# Altium schematic sheet controltemperature.SchDoc
size A
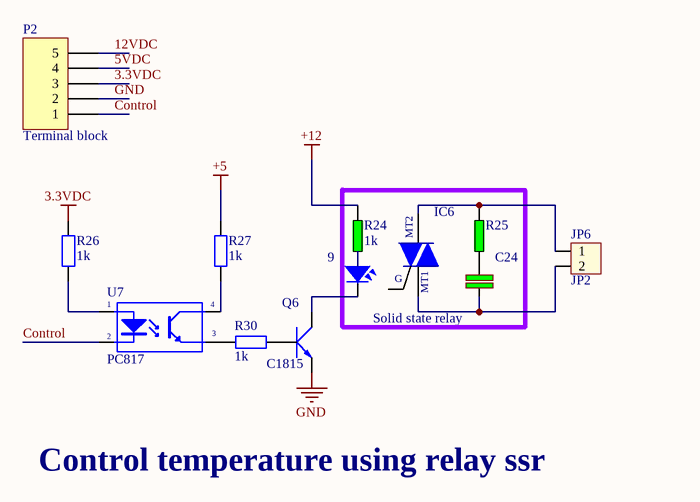
[diagram p0: controltemperature.SchDoc]

## Parts
9  Solid state relay  [LED-3]
C24  (no value)  [CN1]
IC6  (no value)  [QTO-220]
JP6  JP2  [CON2]
P2  Terminal block  [HDR1X5]
Q6  C1815  [QTO-92]
R24  1k  [SM-1206]
R25  (no value)  [SM-1206]
R26  1k  [R1/4W]
R27  1k  [R1/4W]
R30  1k  [R1/4W]
U7  PC817  [DIP4/W0.3]

## Nets
3.3VDC: P2.3 R26.2
+5: R27.2
+12: R24.2
GND: P2.2 Q6.1(E)
5VDC: P2.4
12VDC: P2.5
Control: P2.1 U7.2(K)
Net9_1: 9.1 R24.1
Net9_2: 9.2 Q6.2(C)
NetC24_1: C24.1 IC6.1(MT1) JP6.2
NetC24_2: C24.2 R25.1
NetIC6_2: IC6.2(MT2) JP6.1 R25.2
NetQ6_3: Q6.3(B) R30.2
NetR26_1: R26.1 U7.1(A)
NetR27_1: R27.1 U7.4(C)
NetR30_1: R30.1 U7.3(E)

Not connected (* = marked no-connect by the designer): IC6 3(IN)

## Notes on the sheet
- Control temperature using relay ssr
- (in symbol BT137) G

## Library data of the parts
9 = LED: LED Single colour Green and Red; Value: LED 3 ly Single Colour
C24 = CAP: Cap np  1pF - 472pF; Value: 100pF
IC6 = BT137: Triacs - 8A; Value: LM317
JP6 = Con2: Connector 2; Value: Connector 2
P2 = Header 5: Header, 5-Pin; LatestRevisionDate: 17-Jul-2002; LatestRevisionNote: Re-released for DXP Platform.; Publisher: Altium Limited
Q6 = C1815: NPN 600mW, ECB; Value: C1815
R24 R25 = RES: Resistor 1/4W; Value: R1/4W - 1K
R26 R27 R30 = R1/4W: Resistor 1/4W; Value: R1/4W - 1K
U7 = PC817: Single Opto; Value: PC817